# Altium schematic sheet MIPI_Panel.SchDoc
size C
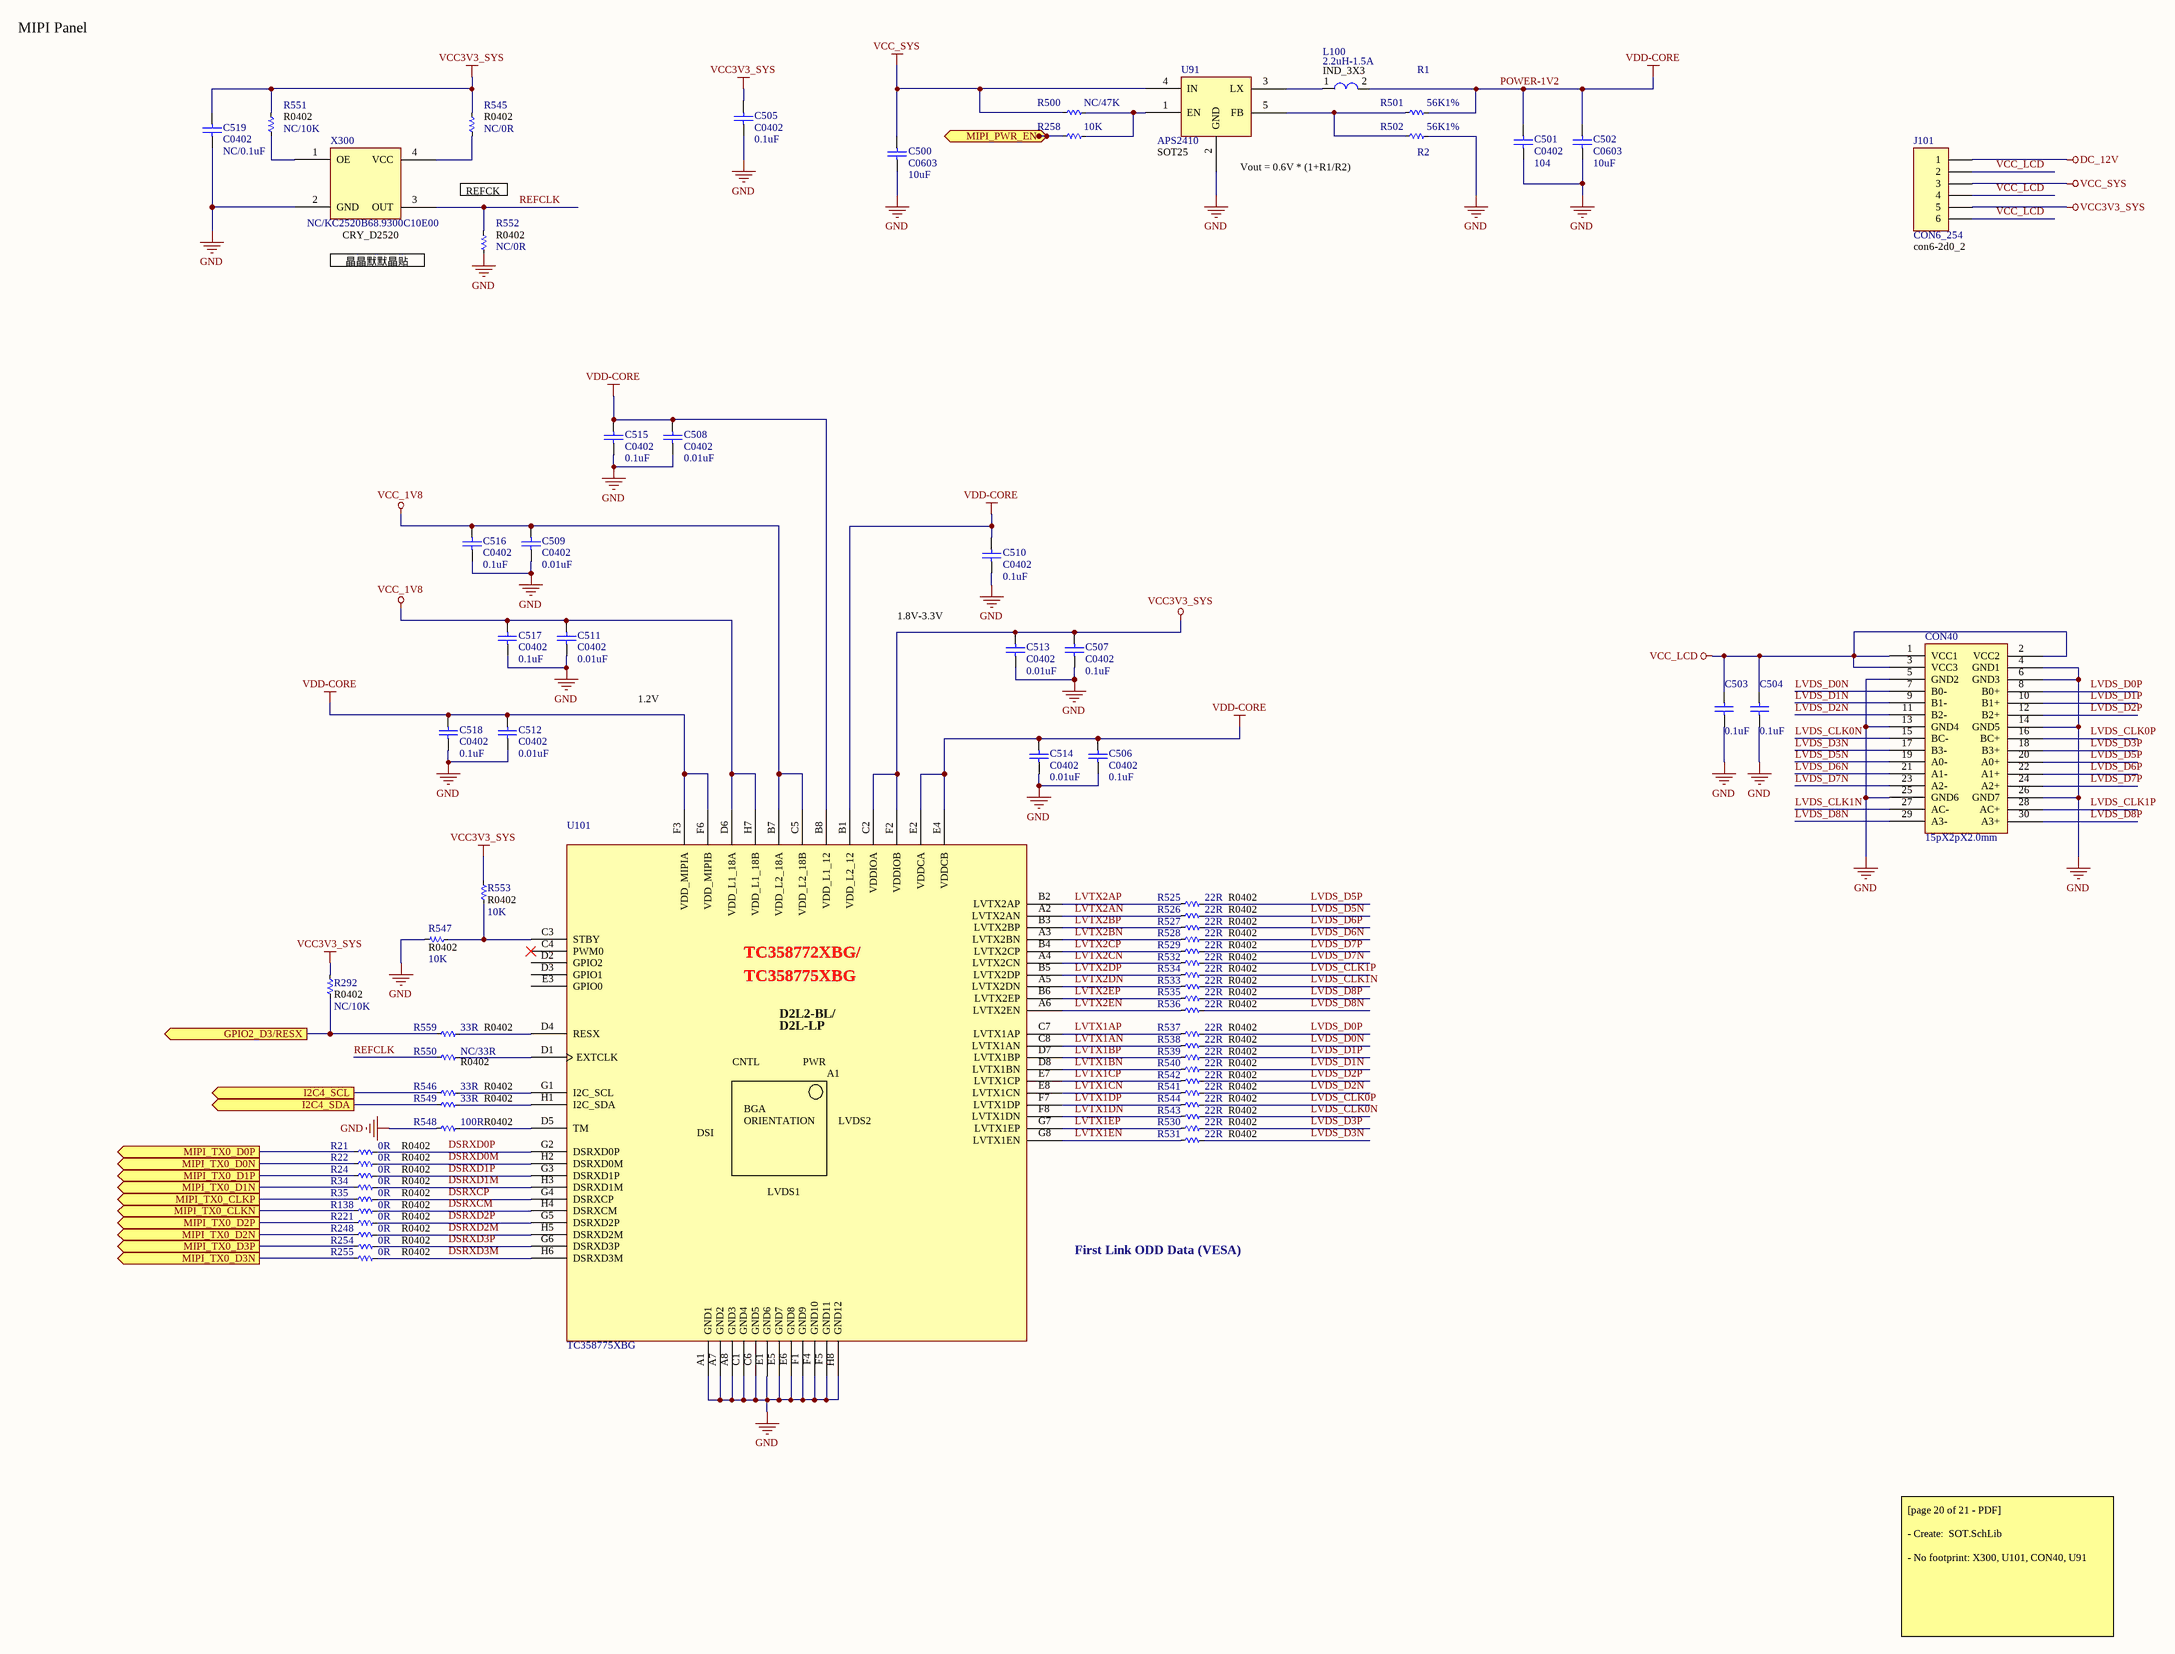
[diagram p0: MIPI_Panel.SchDoc]

## Parts
C500  C0603  value 10uF  [C 0603]
C501  C0402  value 104  [C 0402]
C502  C0603  value 10uF  [C 0603]
C503  value 0.1uF  [C 0402]  (hidden comment: C0402)
C504  value 0.1uF  [C 0402]  (hidden comment: C0402)
C505  C0402  value 0.1uF  [C 0402]
C506  C0402  value 0.1uF  [C 0402]
C507  C0402  value 0.1uF  [C 0402]
C508  C0402  value 0.01uF  [C 0402]
C509  C0402  value 0.01uF  [C 0402]
C510  C0402  value 0.1uF  [C 0402]
C511  C0402  value 0.01uF  [C 0402]
C512  C0402  value 0.01uF  [C 0402]
C513  C0402  value 0.01uF  [C 0402]
C514  C0402  value 0.01uF  [C 0402]
C515  C0402  value 0.1uF  [C 0402]
C516  C0402  value 0.1uF  [C 0402]
C517  C0402  value 0.1uF  [C 0402]
C518  C0402  value 0.1uF  [C 0402]
C519  C0402  value NC/0.1uF  [C 0402]
CON40  15pX2pX2.0mm  [JP15-D2T]
J101  CON6_254  [Header6]
L100  2.2uH-1.5A  [L-SMD-M-7.3x4.5]
R21  R0402  value 0R  [R 0402]
R22  R0402  value 0R  [R 0402]
R24  R0402  value 0R  [R 0402]
R34  R0402  value 0R  [R 0402]
R35  R0402  value 0R  [R 0402]
R138  R0402  value 0R  [R 0402]
R221  R0402  value 0R  [R 0402]
R248  R0402  value 0R  [R 0402]
R254  R0402  value 0R  [R 0402]
R255  R0402  value 0R  [R 0402]
R258  value 10K  [R 0402]  (hidden comment: R0402)
R292  R0402  value NC/10K  [R 0402]
R500  value NC/47K  [R 0402]  (hidden comment: R0402)
R501  value 56K1%  [R 0402]  (hidden comment: R0402)
R502  value 56K1%  [R 0402]  (hidden comment: R0402)
R525  R0402  value 22R  [R 0402]
R526  R0402  value 22R  [R 0402]
R527  R0402  value 22R  [R 0402]
R528  R0402  value 22R  [R 0402]
R529  R0402  value 22R  [R 0402]
R530  R0402  value 22R  [R 0402]
R531  R0402  value 22R  [R 0402]
R532  R0402  value 22R  [R 0402]
R533  R0402  value 22R  [R 0402]
R534  R0402  value 22R  [R 0402]
R535  R0402  value 22R  [R 0402]
R536  R0402  value 22R  [R 0402]
R537  R0402  value 22R  [R 0402]
R538  R0402  value 22R  [R 0402]
R539  R0402  value 22R  [R 0402]
R540  R0402  value 22R  [R 0402]
R541  R0402  value 22R  [R 0402]
R542  R0402  value 22R  [R 0402]
R543  R0402  value 22R  [R 0402]
R544  R0402  value 22R  [R 0402]
R545  R0402  value NC/0R  [R 0402]
R546  R0402  value 33R  [R 0402]
R547  R0402  value 10K  [R 0402]
R548  R0402  value 100R  [R 0402]
R549  R0402  value 33R  [R 0402]
R550  R0402  value NC/33R  [R 0402]
R551  R0402  value NC/10K  [R 0402]
R552  R0402  value NC/0R  [R 0402]
R553  R0402  value 10K  [R 0402]
R559  R0402  value 33R  [R 0402]
U91  APS2410  Package: SOT25  [SOT-23-5]
U101  TC358775XBG  [BGA-64-TC358774XBG]
X300  NC/KC2520B68.9300C10E00  [Crystal 4-SMD 32x25]

## Ports
GPIO2_D3/RESX (out), I2C4_SCL (out), I2C4_SDA (out), MIPI_PWR_EN (in), MIPI_TX0_CLKN (out), MIPI_TX0_CLKP (out), MIPI_TX0_D0N (out), MIPI_TX0_D0P (out), MIPI_TX0_D1N (out), MIPI_TX0_D1P (out), MIPI_TX0_D2N (out), MIPI_TX0_D2P (out), MIPI_TX0_D3N (out), MIPI_TX0_D3P (out)

## Nets
DC_12V: J101.1
GND: C500.2 C501.2 C502.2 C503.2 C504.2 C505.2 C506.2 C507.2 C508.2 C509.2 C510.2 C511.2 C512.2 C513.2 C514.2 C515.2 C516.2 C517.2 C518.2 C519.2 CON40.4(GND1) CON40.5(GND2) CON40.6(GND3) CON40.13(GND4) CON40.14(GND5) CON40.25(GND6) CON40.26(GND7) R502.1 R547.1 R548.2 R552.2 U91.2(GND) U101.A1(GND1) U101.A7(GND2) U101.A8(GND3) U101.C1(GND4) U101.C6(GND5) U101.E1(GND6) U101.E5(GND7) U101.E6(GND8) U101.F1(GND9) U101.F4(GND10) U101.F5(GND11) U101.H8(GND12) X300.2(GND)
POWER-1V2: C501.1 C502.1 C506.1 C508.1 C510.1 C512.1 C514.1 C515.1 C518.1 L100.2 R501.1 U101.B1(VDD_L2_12) U101.B8(VDD_L1_12) U101.E2(VDDCA) U101.E4(VDDCB) U101.F3(VDD_MIPIA) U101.F6(VDD_MIPIB)  [also labelled VDD-CORE]
VCC3V3_SYS: C505.1 C507.1 C513.1 C519.1 J101.5 R292.1 R545.1 R551.1 R553.2 U101.C2(VDDIOA) U101.F2(VDDIOB)
VCC_1V8: C509.1 C511.1 C516.1 C517.1 U101.B7(VDD_L2_18A) U101.C5(VDD_L2_18B) U101.D6(VDD_L1_18A) U101.H7(VDD_L1_18B)
VCC_LCD: C503.1 C504.1 CON40.1(VCC1) CON40.2(VCC2) CON40.3(VCC3) J101.2 J101.4 J101.6
VCC_SYS: C500.1 J101.3 R500.2 U91.4(IN)
DSRXCM: R138.1 U101.H4(DSRXCM)
DSRXCP: R35.1 U101.G4(DSRXCP)
DSRXD0M: R22.1 U101.H2(DSRXD0M)
DSRXD0P: R21.1 U101.G2(DSRXD0P)
DSRXD1M: R34.1 U101.H3(DSRXD1M)
DSRXD1P: R24.1 U101.G3(DSRXD1P)
DSRXD2M: R248.1 U101.H5(DSRXD2M)
DSRXD2P: R221.1 U101.G5(DSRXD2P)
DSRXD3M: R255.1 U101.H6(DSRXD3M)
DSRXD3P: R254.1 U101.G6(DSRXD3P)
GPIO2_D3/RESX: R292.2 R559.2 ; port GPIO2_D3/RESX
I2C4_SCL: R546.2 ; port I2C4_SCL
I2C4_SDA: R549.2 ; port I2C4_SDA
LVDS_CLK0N: CON40.15(BC-) R543.1
LVDS_CLK0P: CON40.16(BC+) R544.1
LVDS_CLK1N: CON40.27(AC-) R533.1
LVDS_CLK1P: CON40.28(AC+) R534.1
LVDS_D0N: CON40.7(B0-) R538.1
LVDS_D0P: CON40.8(B0+) R537.1
LVDS_D1N: CON40.9(B1-) R540.1
LVDS_D1P: CON40.10(B1+) R539.1
LVDS_D2N: CON40.11(B2-) R541.1
LVDS_D2P: CON40.12(B2+) R542.1
LVDS_D3N: CON40.17(B3-) R531.1
LVDS_D3P: CON40.18(B3+) R530.1
LVDS_D5N: CON40.19(A0-) R526.1
LVDS_D5P: CON40.20(A0+) R525.1
LVDS_D6N: CON40.21(A1-) R528.1
LVDS_D6P: CON40.22(A1+) R527.1
LVDS_D7N: CON40.23(A2-) R532.1
LVDS_D7P: CON40.24(A2+) R529.1
LVDS_D8N: CON40.29(A3-) R536.1
LVDS_D8P: CON40.30(A3+) R535.1
LVTX1AN: R538.2 U101.C8(LVTX1AN)
LVTX1AP: R537.2 U101.C7(LVTX1AP)
LVTX1BN: R540.2 U101.D8(LVTX1BN)
LVTX1BP: R539.2 U101.D7(LVTX1BP)
LVTX1CN: R541.2 U101.E8(LVTX1CN)
LVTX1CP: R542.2 U101.E7(LVTX1CP)
LVTX1DN: R543.2 U101.F8(LVTX1DN)
LVTX1DP: R544.2 U101.F7(LVTX1DP)
LVTX1EN: R531.2 U101.G8(LVTX1EN)
LVTX1EP: R530.2 U101.G7(LVTX1EP)
LVTX2AN: R526.2 U101.A2(LVTX2AN)
LVTX2AP: R525.2 U101.B2(LVTX2AP)
LVTX2BN: R528.2 U101.A3(LVTX2BN)
LVTX2BP: R527.2 U101.B3(LVTX2BP)
LVTX2CN: R532.2 U101.A4(LVTX2CN)
LVTX2CP: R529.2 U101.B4(LVTX2CP)
LVTX2DN: R533.2 U101.A5(LVTX2DN)
LVTX2DP: R534.2 U101.B5(LVTX2DP)
LVTX2EN: R536.2 U101.A6(LVTX2EN)
LVTX2EP: R535.2 U101.B6(LVTX2EP)
MIPI_PWR_EN: R258.2 ; port MIPI_PWR_EN
MIPI_TX0_CLKN: R138.2 ; port MIPI_TX0_CLKN
MIPI_TX0_CLKP: R35.2 ; port MIPI_TX0_CLKP
MIPI_TX0_D0N: R22.2 ; port MIPI_TX0_D0N
MIPI_TX0_D0P: R21.2 ; port MIPI_TX0_D0P
MIPI_TX0_D1N: R34.2 ; port MIPI_TX0_D1N
MIPI_TX0_D1P: R24.2 ; port MIPI_TX0_D1P
MIPI_TX0_D2N: R248.2 ; port MIPI_TX0_D2N
MIPI_TX0_D2P: R221.2 ; port MIPI_TX0_D2P
MIPI_TX0_D3N: R255.2 ; port MIPI_TX0_D3N
MIPI_TX0_D3P: R254.2 ; port MIPI_TX0_D3P
REFCLK: R550.2 R552.1 X300.3(OUT)
NetL100_1: L100.1 U91.3(LX)
NetR258_1: R258.1 R500.1 U91.1(EN)
NetR501_2: R501.2 R502.2 U91.5(FB)
NetR545_2: R545.2 X300.4(VCC)
NetR546_1: R546.1 U101.G1(I2C_SCL)
NetR547_2: R547.2 R553.1 U101.C3(STBY)
NetR548_1: R548.1 U101.D5(TM)
NetR549_1: R549.1 U101.H1(I2C_SDA)
NetR550_1: R550.1 U101.D1(EXTCLK)
NetR551_2: R551.2 X300.1(OE)
NetR559_1: R559.1 U101.D4(RESX)

Not connected (* = marked no-connect by the designer): U101 C4(PWM0)* D2(GPIO2) D3(GPIO1) E3(GPIO0)

## Notes on the sheet
- MIPI Panel
- (near R501) R1
- (near U91) Vout = 0.6V * (1+R1/R2)
- (near R502) R2
- REFCK
- 晶晶默默晶贴
- 1.8V-3.3V
- 1.2V
- First Link ODD Data (VESA)
- [page 20 of 21 - PDF]
  - Create:  SOT.SchLib
  - No footprint: X300, U101, CON40, U91
- (in symbol Header 6) con6-2d0_2
- (in symbol L-SMD-1) IND_3X3
- (in symbol TC358775XBG) TC358772XBG/; D2L2-BL/; D2L-LP; CNTL; PWR; BGA; ORIENTATION; LVDS2; DSI; LVDS1

## Library data of the parts
C500-C519 = Cap: Capacitor; Published: 8-Jun-2000; LatestRevisionDate: 17-Jul-2002; LatestRevisionNote: Re-released for DXP Platform.; PackageReference: RAD-0.3; Publisher: Altium Limited; PackageDescription: Radial Cap, Thru-Hole; 2 Leads; 0.3 in Pin Spacing
J101 = Header 6: Header, 6-Pin; LatestRevisionDate: 17-Jul-2002; LatestRevisionNote: Re-released for DXP Platform.; Publisher: Altium Limited
L100 = L-SMD-1: partNo: 78477010; Manufacturer: Wurth Elektronik; Inductance: 1.0 μH; ComponentLink1Description: Manufacturer; ComponentLink1URL: http://www.we-online.de; Created by: Baojun Chen; Created Date: Nov.2015; ComponentLink2Description: Datasheet; ComponentLink2URL: http://katalog.we-online.de/pbs/datasheet/78477010.pdf
R21 R22 R24 R34 R35 R138 R221 R248 R254 R255 R258 R292 R500-R502 R525-R553 R559 = Res-SMD: Resistor; Manufacturer: Generic Components; Class: Passive; Published: 08/06/2000; Publisher: Altium Hobart Technology Centre
X300 = CRY_D2520